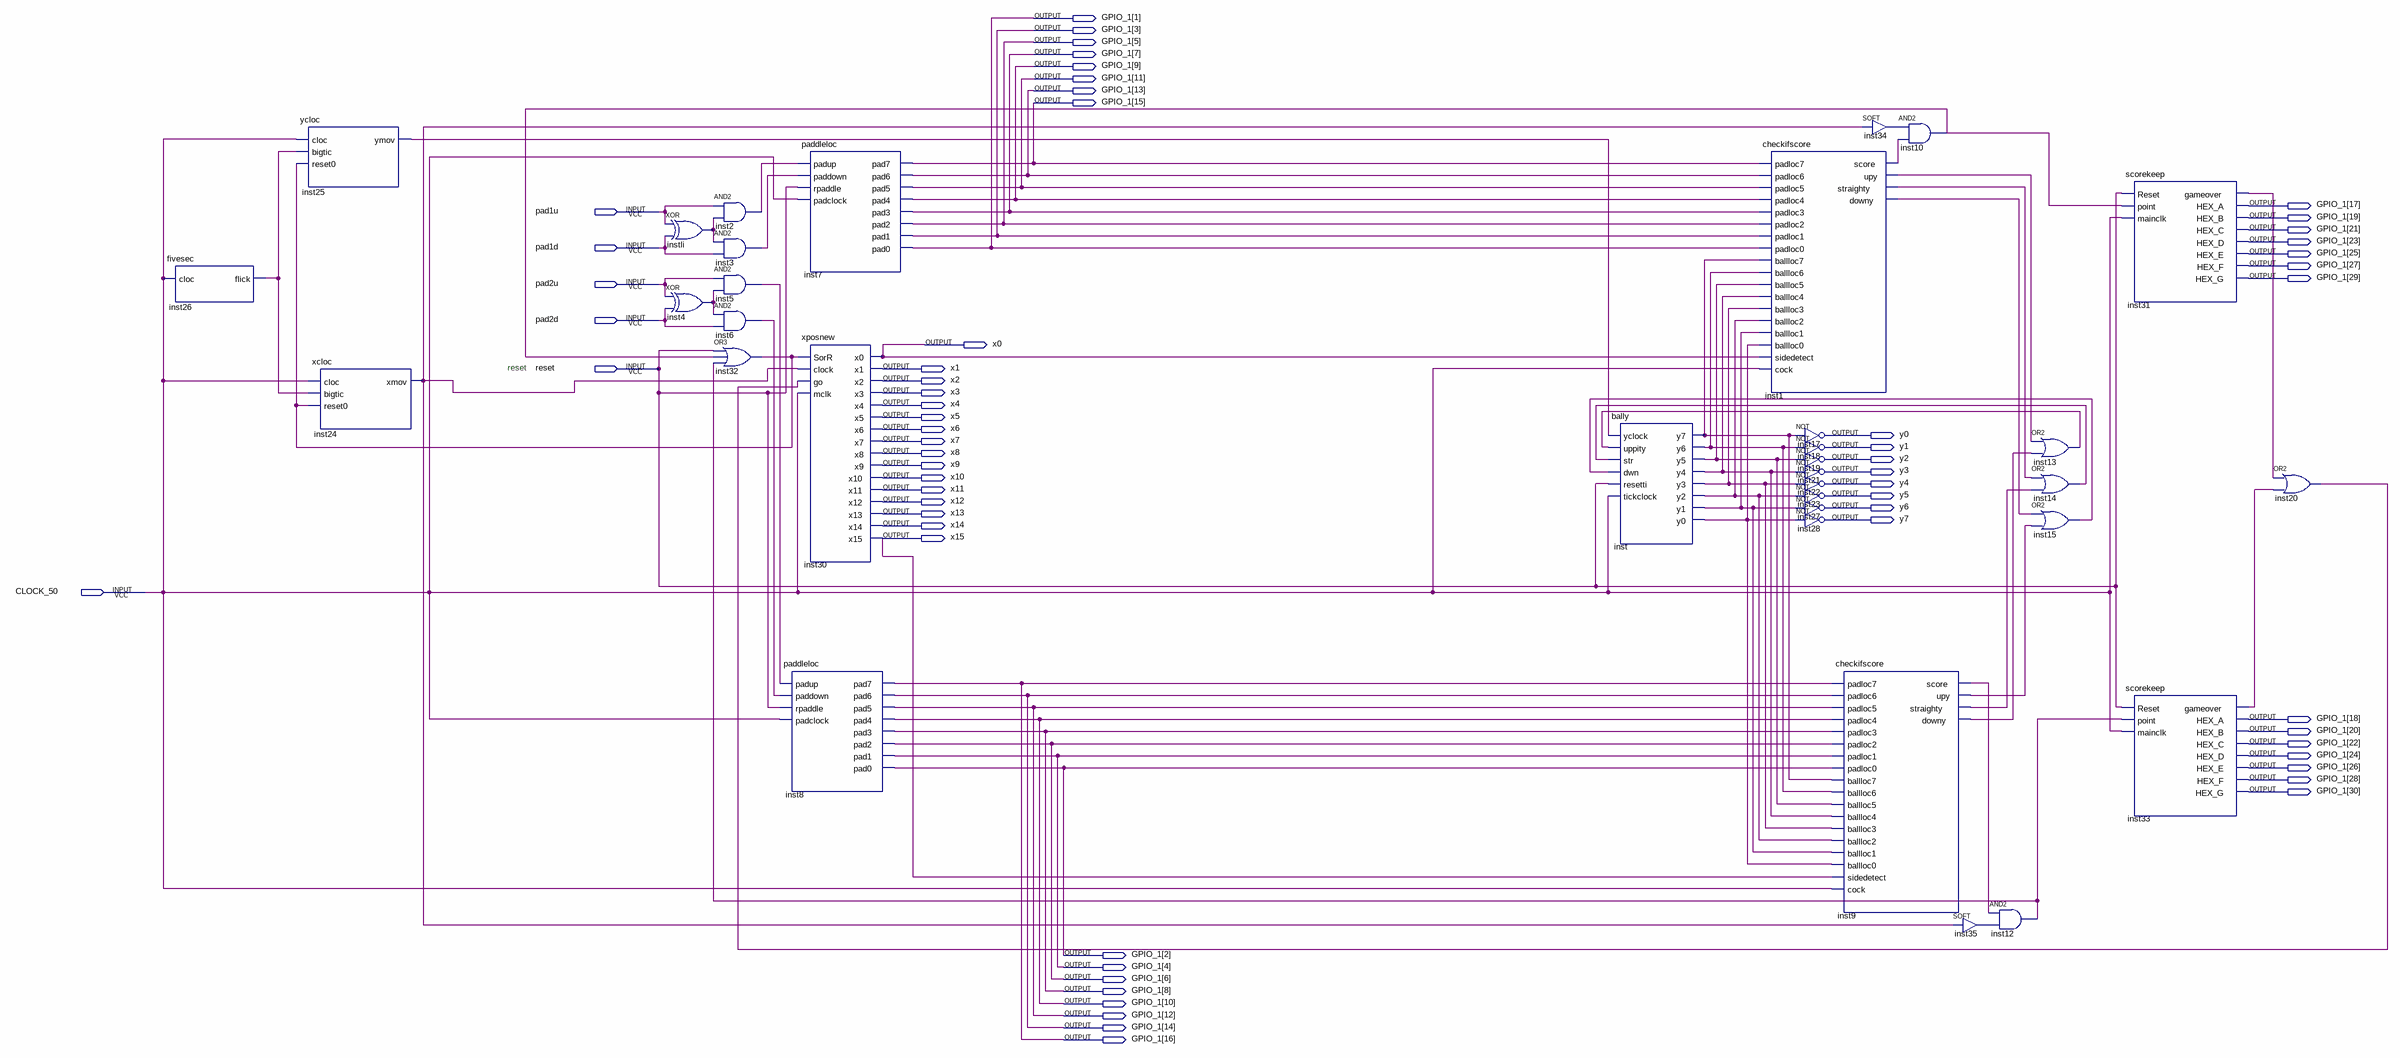
[diagram p0: schematic sheet]
// Quartus schematic final.bdf as structural Verilog: 34 symbols, 60 pins
module \final  (
  input  pad1u,
  input  pad1d,
  input  pad2u,
  input  pad2d,
  input  reset,
  input  CLOCK_50,
  output [30:1] GPIO_1,
  output x0,
  output x1,
  output x2,
  output x3,
  output x4,
  output x5,
  output x6,
  output y0,
  output x7,
  output y1,
  output x8,
  output y2,
  output x9,
  output y3,
  output x10,
  output y4,
  output x11,
  output y5,
  output x12,
  output y6,
  output x13,
  output y7,
  output x14,
  output x15
);

  wire inst1_downy, inst1_score, inst1_straighty, inst1_upy, inst2_out, inst3_out, inst4_out, inst5_out,
       inst6_out, inst9_downy, inst9_score, inst9_straighty, inst9_upy, inst10_out, inst12_out, inst13_out,
       inst14_out, inst15_out, inst20_out, inst24_xmov, inst25_ymov, inst26_flick, inst31_gameover,
       inst32_out, inst33_gameover, inst34_out, inst35_out, inst_y0, inst_y1, inst_y2, inst_y3, inst_y4,
       inst_y5, inst_y6, inst_y7, instli_out;

  fivesec inst26 (.cloc(CLOCK_50), .flick(inst26_flick));
  ycloc inst25 (.cloc(CLOCK_50), .bigtic(inst26_flick), .reset0(inst32_out), .ymov(inst25_ymov));
  xcloc inst24 (.cloc(CLOCK_50), .bigtic(inst26_flick), .reset0(inst32_out), .xmov(inst24_xmov));
  xor instli (instli_out, pad1u, pad1d);
  xor inst4 (inst4_out, pad2u, pad2d);
  and inst2 (inst2_out, pad1u, instli_out);
  and inst3 (inst3_out, instli_out, pad1d);
  and inst5 (inst5_out, pad2u, inst4_out);
  and inst6 (inst6_out, inst4_out, pad2d);
  or inst32 (inst32_out, reset, inst10_out, inst12_out);
  paddleloc inst7 (
    .padup(inst2_out), .paddown(inst3_out), .rpaddle(reset), .padclock(CLOCK_50), .pad7(GPIO_1[15]),
    .pad6(GPIO_1[13]), .pad5(GPIO_1[11]), .pad4(GPIO_1[9]), .pad3(GPIO_1[7]), .pad2(GPIO_1[5]),
    .pad1(GPIO_1[3]), .pad0(GPIO_1[1]));
  xposnew inst30 (
    .SorR(inst32_out), .clock(inst24_xmov), .go(inst20_out), .mclk(CLOCK_50), .x0(x0), .x1(x1), .x2(x2),
    .x3(x3), .x4(x4), .x5(x5), .x6(x6), .x7(x7), .x8(x8), .x9(x9), .x10(x10), .x11(x11), .x12(x12),
    .x13(x13), .x14(x14), .x15(x15));
  paddleloc inst8 (
    .padup(inst5_out), .paddown(inst6_out), .rpaddle(reset), .padclock(CLOCK_50), .pad7(GPIO_1[16]),
    .pad6(GPIO_1[14]), .pad5(GPIO_1[12]), .pad4(GPIO_1[10]), .pad3(GPIO_1[8]), .pad2(GPIO_1[6]),
    .pad1(GPIO_1[4]), .pad0(GPIO_1[2]));
  bally inst (
    .yclock(inst25_ymov), .uppity(inst13_out), .str(inst14_out), .dwn(inst15_out), .resetti(reset),
    .tickclock(CLOCK_50), .y7(inst_y7), .y6(inst_y6), .y5(inst_y5), .y4(inst_y4), .y3(inst_y3), .y2(inst_y2),
    .y1(inst_y1), .y0(inst_y0));
  checkifscore inst1 (
    .padloc7(GPIO_1[15]), .padloc6(GPIO_1[13]), .padloc5(GPIO_1[11]), .padloc4(GPIO_1[9]),
    .padloc3(GPIO_1[7]), .padloc2(GPIO_1[5]), .padloc1(GPIO_1[3]), .padloc0(GPIO_1[1]), .ballloc7(inst_y7),
    .ballloc6(inst_y6), .ballloc5(inst_y5), .ballloc4(inst_y4), .ballloc3(inst_y3), .ballloc2(inst_y2),
    .ballloc1(inst_y1), .ballloc0(inst_y0), .sidedetect(x0), .cock(CLOCK_50), .score(inst1_score),
    .upy(inst1_upy), .straighty(inst1_straighty), .downy(inst1_downy));
  not inst17 (y0, inst_y7);
  not inst18 (y1, inst_y6);
  not inst19 (y2, inst_y5);
  not inst21 (y3, inst_y4);
  not inst22 (y4, inst_y3);
  not inst23 (y5, inst_y2);
  not inst27 (y6, inst_y1);
  not inst28 (y7, inst_y0);
  checkifscore inst9 (
    .padloc7(GPIO_1[16]), .padloc6(GPIO_1[14]), .padloc5(GPIO_1[12]), .padloc4(GPIO_1[10]),
    .padloc3(GPIO_1[8]), .padloc2(GPIO_1[6]), .padloc1(GPIO_1[4]), .padloc0(GPIO_1[2]), .ballloc7(inst_y7),
    .ballloc6(inst_y6), .ballloc5(inst_y5), .ballloc4(inst_y4), .ballloc3(inst_y3), .ballloc2(inst_y2),
    .ballloc1(inst_y1), .ballloc0(inst_y0), .sidedetect(x15), .cock(CLOCK_50), .score(inst9_score),
    .upy(inst9_upy), .straighty(inst9_straighty), .downy(inst9_downy));
  SOFT inst34 (.IN(inst24_xmov), .OUT(inst34_out));
  and inst10 (inst10_out, inst34_out, inst1_score);
  SOFT inst35 (.IN(inst24_xmov), .OUT(inst35_out));
  and inst12 (inst12_out, inst9_score, inst35_out);
  or inst13 (inst13_out, inst1_upy, inst9_downy);
  or inst14 (inst14_out, inst1_straighty, inst9_straighty);
  or inst15 (inst15_out, inst1_downy, inst9_upy);
  scorekeep inst31 (
    .Reset(reset), .point(inst10_out), .mainclk(CLOCK_50), .gameover(inst31_gameover), .HEX_A(GPIO_1[17]),
    .HEX_B(GPIO_1[19]), .HEX_C(GPIO_1[21]), .HEX_D(GPIO_1[23]), .HEX_E(GPIO_1[25]), .HEX_F(GPIO_1[27]),
    .HEX_G(GPIO_1[29]));
  scorekeep inst33 (
    .Reset(reset), .point(inst12_out), .mainclk(CLOCK_50), .gameover(inst33_gameover), .HEX_A(GPIO_1[18]),
    .HEX_B(GPIO_1[20]), .HEX_C(GPIO_1[22]), .HEX_D(GPIO_1[24]), .HEX_E(GPIO_1[26]), .HEX_F(GPIO_1[28]),
    .HEX_G(GPIO_1[30]));
  or inst20 (inst20_out, inst31_gameover, inst33_gameover);

  // Notes on the sheet:
  //   reset
endmodule
